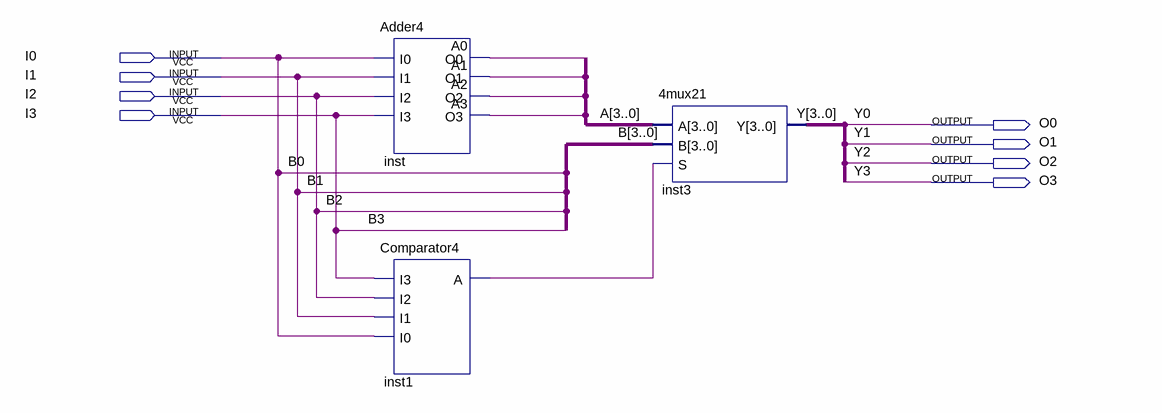
[diagram p0: schematic sheet]
// Quartus schematic ComparativeAdder4.bdf as structural Verilog: 3 symbols, 8 pins
module ComparativeAdder4 (
  input  I0,
  input  I1,
  input  I2,
  input  I3,
  output O0,
  output O1,
  output O2,
  output O3
);

  wire inst1_a;
  wire [3:0] A;

  Adder4 inst (.I0(I0), .I1(I1), .I2(I2), .I3(I3), .O0(A[0]), .O1(A[1]), .O2(A[2]), .O3(A[3]));
  Comparator4 inst1 (.I3(I3), .I2(I2), .I1(I1), .I0(I0), .A(inst1_a));
  \4mux21  inst3 (.A(A), .B({I3, I2, I1, I0}), .S(inst1_a), .Y({O3, O2, O1, O0}));

  // Other names for the same wires on the sheet: B[3:0] = {I3, I2, I1, I0}; B0 = I0; B1 = I1; B2 = I2; B3 = I3;
  //   Y[3:0] = {O3, O2, O1, O0}; Y0 = O0; Y1 = O1; Y2 = O2; Y3 = O3
endmodule
